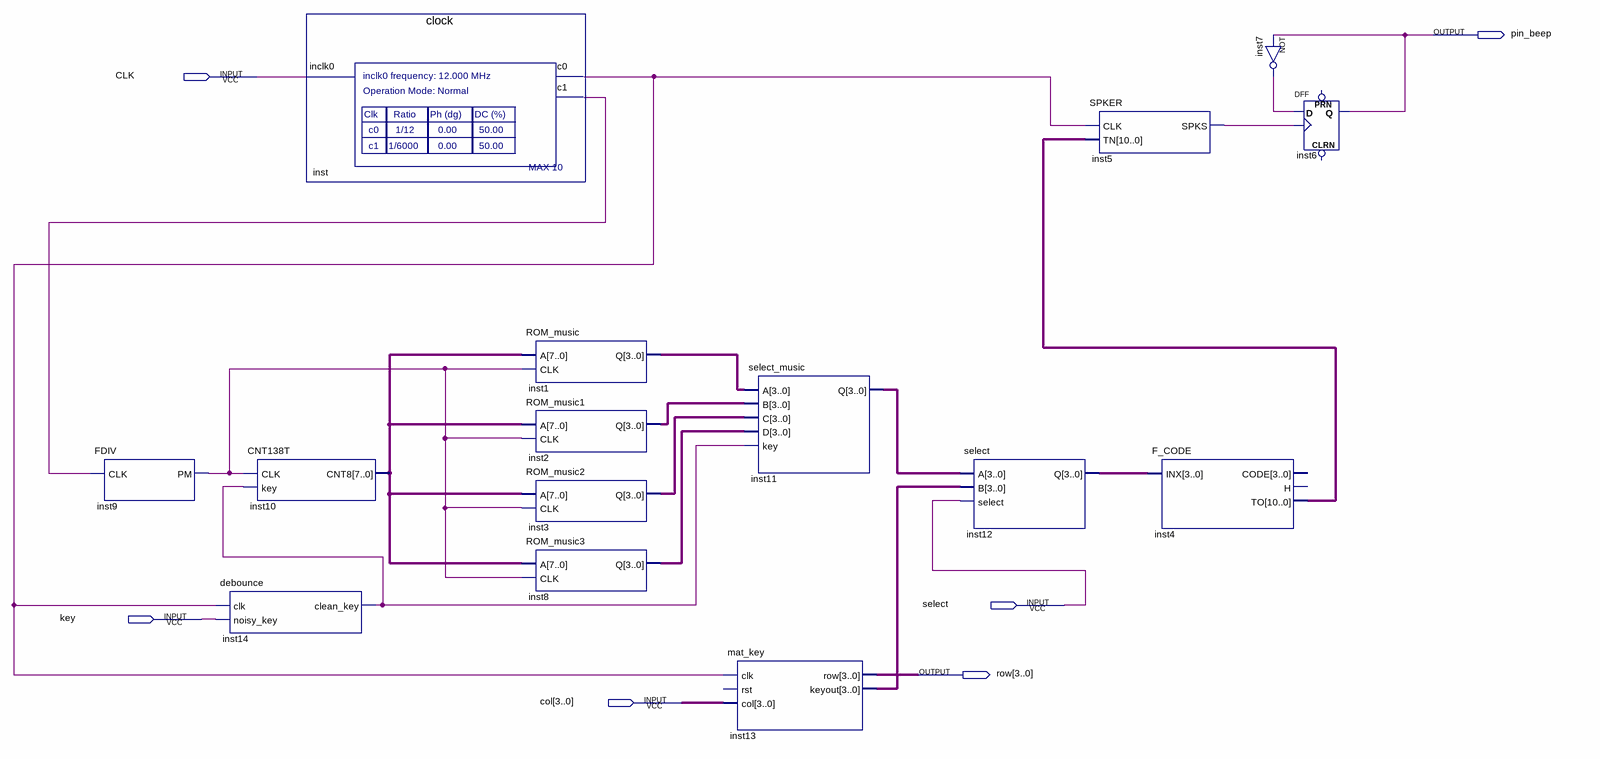
[diagram p0: schematic sheet]
// Quartus schematic piano.bdf as structural Verilog: 15 symbols, 6 pins
module piano (
  input  CLK,
  input  select,
  input  key,
  input  [3:0] col,
  output pin_beep,
  output [3:0] row
);

  wire inst5_spks, inst7_out, inst9_pm, inst14_clean_key, inst_c0, inst_c1;
  wire [3:0] inst1_q, inst2_q, inst3_q, inst8_q, inst11_q, inst12_q, inst13_keyout;
  wire [7:0] inst10_cnt8;
  wire [10:0] inst4_to;

  FDIV inst9 (.CLK(inst_c1), .PM(inst9_pm));
  debounce inst14 (.clk(inst_c0), .noisy_key(key), .clean_key(inst14_clean_key));
  CNT138T inst10 (.CLK(inst9_pm), .key(inst14_clean_key), .CNT8(inst10_cnt8));
  clock inst (.inclk0(CLK), .c0(inst_c0), .c1(inst_c1));
  ROM_music inst1 (.A(inst10_cnt8), .CLK(inst9_pm), .Q(inst1_q));
  ROM_music1 inst2 (.A(inst10_cnt8), .CLK(inst9_pm), .Q(inst2_q));
  ROM_music2 inst3 (.A(inst10_cnt8), .CLK(inst9_pm), .Q(inst3_q));
  ROM_music3 inst8 (.A(inst10_cnt8), .CLK(inst9_pm), .Q(inst8_q));
  mat_key inst13 (.clk(inst_c0), .col(col), .row(row), .keyout(inst13_keyout));  // open: rst
  select_music inst11 (.A(inst1_q), .B(inst2_q), .C(inst3_q), .D(inst8_q), .key(inst14_clean_key), .Q(inst11_q));
  select inst12 (.A(inst11_q), .B(inst13_keyout), .select(select), .Q(inst12_q));
  SPKER inst5 (.CLK(inst_c0), .TN(inst4_to), .SPKS(inst5_spks));
  F_CODE inst4 (.INX(inst12_q), .TO(inst4_to));  // open: CODE, H
  not inst7 (inst7_out, pin_beep);
  DFF inst6 (.CLK(inst5_spks), .D(inst7_out), .Q(pin_beep));  // open: CLRN, PRN
endmodule
